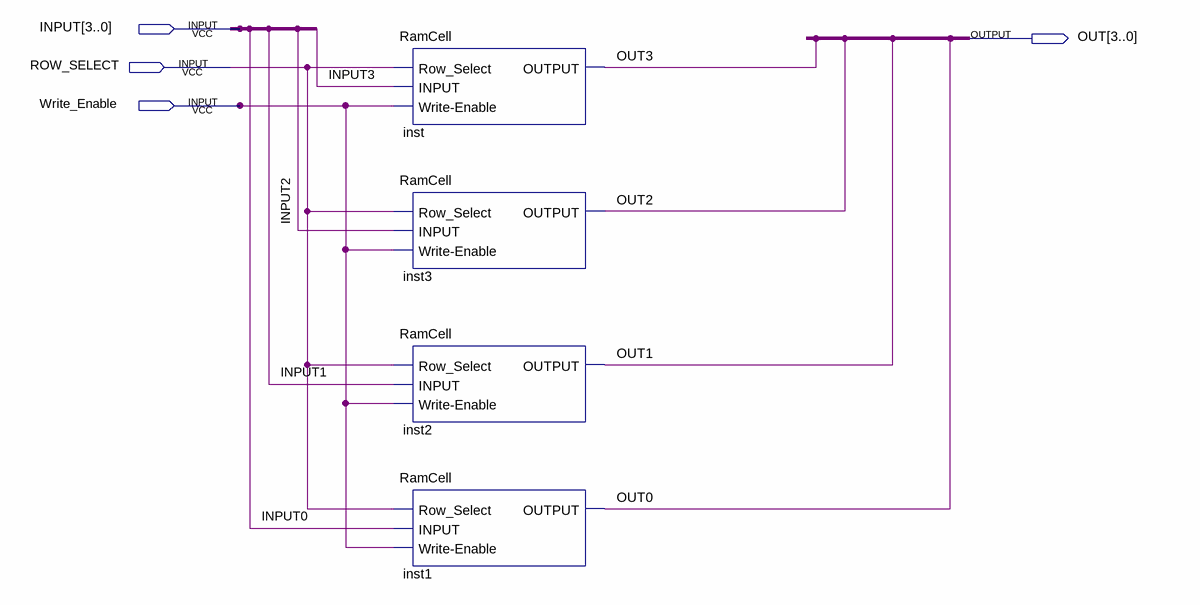
[diagram p0: schematic sheet]
// Quartus schematic 4BIT_RAMCELL.bdf as structural Verilog: 4 symbols, 4 pins
module \4BIT_RAMCELL  (
  input  [3:0] INPUT,
  input  ROW_SELECT,
  input  Write_Enable,
  output [3:0] OUT
);

  RamCell inst (.Row_Select(ROW_SELECT), .INPUT(INPUT[3]), .\Write-Enable (Write_Enable), .OUTPUT(OUT[3]));
  RamCell inst3 (.Row_Select(ROW_SELECT), .INPUT(INPUT[2]), .\Write-Enable (Write_Enable), .OUTPUT(OUT[2]));
  RamCell inst2 (.Row_Select(ROW_SELECT), .INPUT(INPUT[1]), .\Write-Enable (Write_Enable), .OUTPUT(OUT[1]));
  RamCell inst1 (.Row_Select(ROW_SELECT), .INPUT(INPUT[0]), .\Write-Enable (Write_Enable), .OUTPUT(OUT[0]));
endmodule
